# EAGLE design MicroNovaDisplayRevX3 (EAGLE 7.4.0)
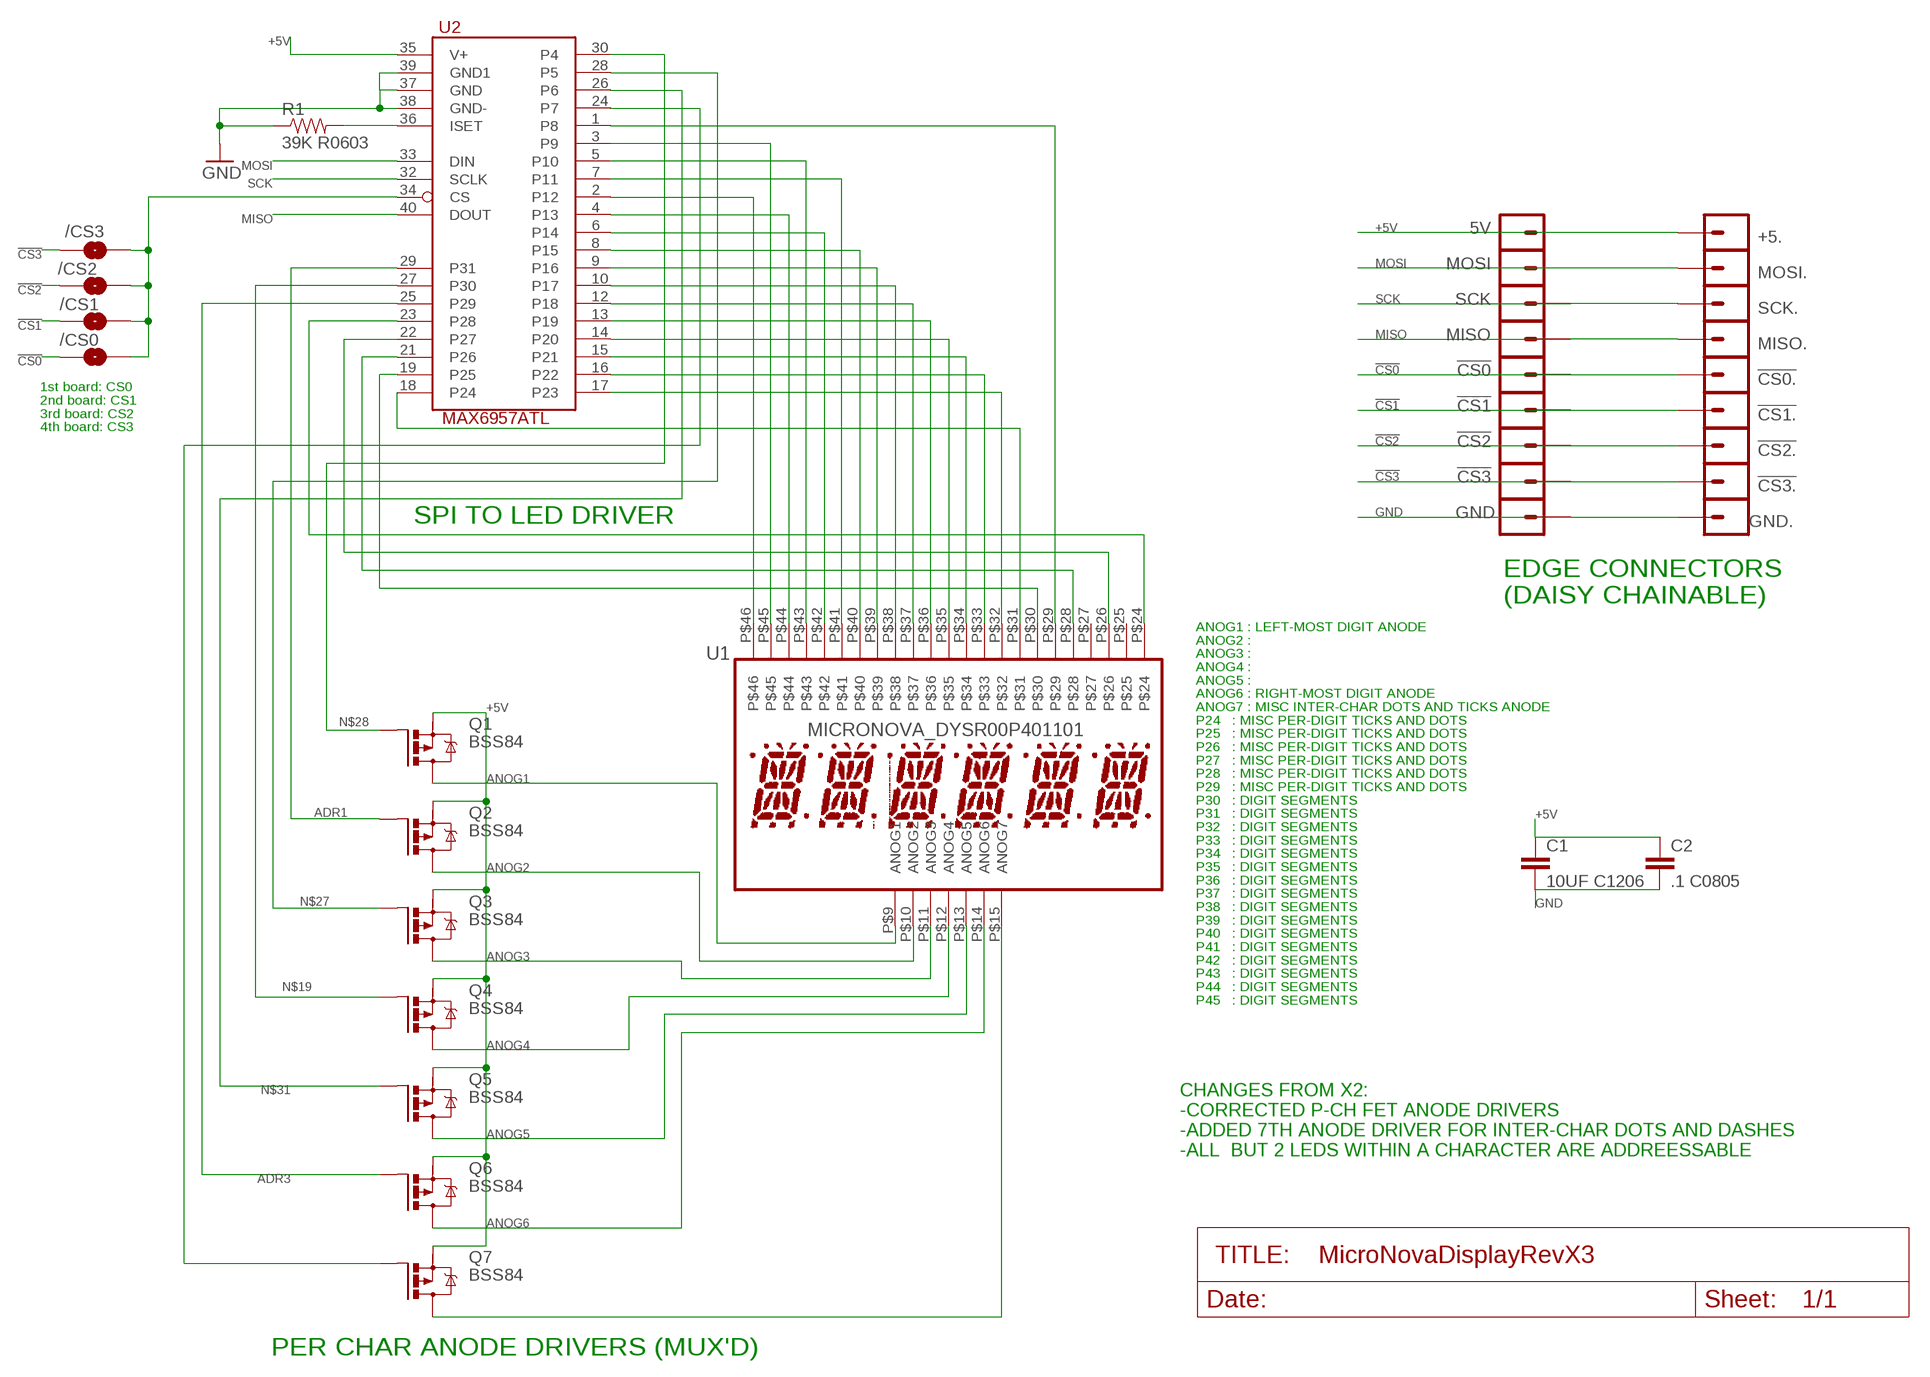
[diagram p0: schematic, sheet 1]

## Parts
5V  M01  [1X01_SMT_2MM]
!CS0  M01  [1X01_SMT_2MM]
!CS0.  M01  [1X01_SMT_2MM]
!CS1  M01  [1X01_SMT_2MM]
!CS1.  M01  [1X01_SMT_2MM]
!CS2  M01  [1X01_SMT_2MM]
!CS2.  M01  [1X01_SMT_2MM]
!CS3  M01  [1X01_SMT_2MM]
!CS3.  M01  [1X01_SMT_2MM]
+5.  M01  [1X01_SMT_2MM]
/CS0  JUMPER-PAD-2-NOYES_SILK  [PAD-JUMPER-2-NO_YES_SILK]
/CS1  JUMPER-PAD-2-NOYES_SILK  [PAD-JUMPER-2-NO_YES_SILK]
/CS2  JUMPER-PAD-2-NOYES_SILK  [PAD-JUMPER-2-NO_YES_SILK]
/CS3  JUMPER-PAD-2-NOYES_SILK  [PAD-JUMPER-2-NO_YES_SILK]
C1  10UF C1206  CAP1206  [1206]
C2  .1 C0805  CAP0805  [0805]
GND  M01  [1X01_SMT_2MM]
GND.  M01  [1X01_SMT_2MM]
MISO  M01  [1X01_SMT_2MM]
MISO.  M01  [1X01_SMT_2MM]
MOSI  M01  [1X01_SMT_2MM]
MOSI.  M01  [1X01_SMT_2MM]
Q1  BSS84  MOSFET-PCHANNELGATE1_SOURCE2_DRAIN3  [SOT23-3]
Q2  BSS84  MOSFET-PCHANNELGATE1_SOURCE2_DRAIN3  [SOT23-3]
Q3  BSS84  MOSFET-PCHANNELGATE1_SOURCE2_DRAIN3  [SOT23-3]
Q4  BSS84  MOSFET-PCHANNELGATE1_SOURCE2_DRAIN3  [SOT23-3]
Q5  BSS84  MOSFET-PCHANNELGATE1_SOURCE2_DRAIN3  [SOT23-3]
Q6  BSS84  MOSFET-PCHANNELGATE1_SOURCE2_DRAIN3  [SOT23-3]
Q7  BSS84  MOSFET-PCHANNELGATE1_SOURCE2_DRAIN3  [SOT23-3]
R1  39K R0603  RES0603  [0603]
SCK  M01  [1X01_SMT_2MM]
SCK.  M01  [1X01_SMT_2MM]
U1  MICRONOVA_DYSR00P401101  [ALPHANUMERIC]
U2  MAX6957ATL  [TQFP40]

## Nets
!CS0: !CS0..P$1 !CS0.P$1 /CS0.1
!CS1: !CS1..P$1 !CS1.P$1 /CS1.1
!CS2: !CS2..P$1 !CS2.P$1 /CS2.1
!CS3: !CS3..P$1 !CS3.P$1 /CS3.1
+5V: 5V.P$1 +5..P$1 C1.1 C2.1 Q1.2(1S) Q2.2(1S) Q3.2(1S) Q4.2(1S) Q5.2(1S) Q6.2(1S) Q7.2(1S) U2.35(V+)
ADR1: Q2.1(2G) U2.29(P31)
ADR3: Q6.1(2G) U2.25(P29)
ADR4: Q7.1(2G) U2.24(P7)
ADR5: U1.P$30 U2.19(P25)
ADR6: U1.P$28 U2.21(P26)
ANOG1: Q1.3(3D) U1.P$9(ANOG1)
ANOG2: Q2.3(3D) U1.P$10(ANOG2)
ANOG3: Q3.3(3D) U1.P$11(ANOG3)
ANOG4: Q4.3(3D) U1.P$12(ANOG4)
ANOG5: Q5.3(3D) U1.P$13(ANOG5)
ANOG6: Q6.3(3D) U1.P$14(ANOG6)
GND: C1.2 C2.2 GND..P$1 GND.P$1 R1.1 U2.37(GND) U2.38(GND-) U2.39(GND1)
MISO: MISO..P$1 MISO.P$1 U2.40(DOUT)
MOSI: MOSI..P$1 MOSI.P$1 U2.33(DIN)
N$1: U1.P$31 U2.18(P24)
N$2: U1.P$32 U2.17(P23)
N$3: U1.P$33 U2.16(P22)
N$4: U1.P$34 U2.15(P21)
N$5: U1.P$35 U2.14(P20)
N$6: U1.P$36 U2.13(P19)
N$7: U1.P$37 U2.12(P18)
N$8: U1.P$38 U2.10(P17)
N$9: U1.P$39 U2.9(P16)
N$10: U1.P$40 U2.8(P15)
N$11: U1.P$41 U2.7(P11)
N$12: U1.P$42 U2.6(P14)
N$13: R1.2 U2.36(ISET)
N$14: U1.P$43 U2.5(P10)
N$15: U1.P$44 U2.4(P13)
N$16: U1.P$45 U2.3(P9)
N$17: U1.P$46 U2.2(P12)
N$18: U1.P$29 U2.1(P8)
N$19: Q4.1(2G) U2.27(P30)
N$20: /CS0.2 /CS1.2 /CS2.2 /CS3.2 U2.34(CS)
N$22: U1.P$26 U2.22(P27)
N$23: U1.P$24 U2.23(P28)
N$25: Q7.3(3D) U1.P$15(ANOG7)
N$27: Q3.1(2G) U2.28(P5)
N$28: Q1.1(2G) U2.30(P4)
N$31: Q5.1(2G) U2.26(P6)
SCK: SCK..P$1 SCK.P$1 U2.32(SCLK)
Unconnected: U1.P$25 U1.P$27

## Notes on the sheet
- 1st board: CS0
  2nd board: CS1
  3rd board: CS2
  4th board: CS3
- SPI TO LED DRIVER
- EDGE CONNECTORS
  (DAISY CHAINABLE)
- ANOG1 : LEFT-MOST DIGIT ANODE
  ANOG2 :
  ANOG3 :
  ANOG4 :
  ANOG5 :
  ANOG6 : RIGHT-MOST DIGIT ANODE
  ANOG7 : MISC INTER-CHAR DOTS AND TICKS ANODE
  P24   : MISC PER-DIGIT TICKS AND DOTS
  P25   : MISC PER-DIGIT TICKS AND DOTS
  P26   : MISC PER-DIGIT TICKS AND DOTS
  P27   : MISC PER-DIGIT TICKS AND DOTS
  P28   : MISC PER-DIGIT TICKS AND DOTS
  P29   : MISC PER-DIGIT TICKS AND DOTS
  P30   : DIGIT SEGMENTS
  P31   : DIGIT SEGMENTS
  P32   : DIGIT SEGMENTS
  P33   : DIGIT SEGMENTS
  P34   : DIGIT SEGMENTS
  P35   : DIGIT SEGMENTS
  P36   : DIGIT SEGMENTS
  P37   : DIGIT SEGMENTS
  P38   : DIGIT SEGMENTS
  P39   : DIGIT SEGMENTS
  P40   : DIGIT SEGMENTS
  P41   : DIGIT SEGMENTS
  P42   : DIGIT SEGMENTS
  P43   : DIGIT SEGMENTS
  P44   : DIGIT SEGMENTS
  P45   : DIGIT SEGMENTS
- CHANGES FROM X2:
  -CORRECTED P-CH FET ANODE DRIVERS
  -ADDED 7TH ANODE DRIVER FOR INTER-CHAR DOTS AND DASHES
  -ALL  BUT 2 LEDS WITHIN A CHARACTER ARE ADDREESSABLE
- PER CHAR ANODE DRIVERS (MUX'D)

## Library data of the parts
5V !CS0 !CS0. !CS1 !CS1. !CS2 !CS2. !CS3 !CS3. +5. GND GND. MISO MISO. MOSI MOSI. SCK SCK. = MicroNovaDisplayRevX3:M01: Header 1 Standard 1-pin 0.1" header. Use with straight break away headers (SKU : PRT-00116), right angle break away headers (PRT-00553), swiss pins (PRT-00743), machine pins (PRT-00117), and female headers (PRT-00115).
/CS0 /CS1-/CS3 = MicroNovaDisplayRevX3:JUMPER-PAD-2-NO
C1 = MicroNovaDisplayRevX3:CAP1206
C2 = MicroNovaDisplayRevX3:CAP0805
Q1-Q7 = MicroNovaDisplayRevX3:MOSFET-PCHANNEL
R1 = MicroNovaDisplayRevX3:RES0603
U1 = MicroNovaDisplayRevX3:MICRONOVA_DYSR00P401101: Alphanumeric LED Display Common anode. Multiple LEDs on some segments. Multiple LED colors available. Works great with A6282 driver IC. Decimal points are unfornately not connected. SKU: COM-09933.
U2 = MicroNovaDisplayRevX3:MAX6957ATL

## Net classes
1 pwrgnd: drill 0.152 mm, clearance 0.152 mm

## Board
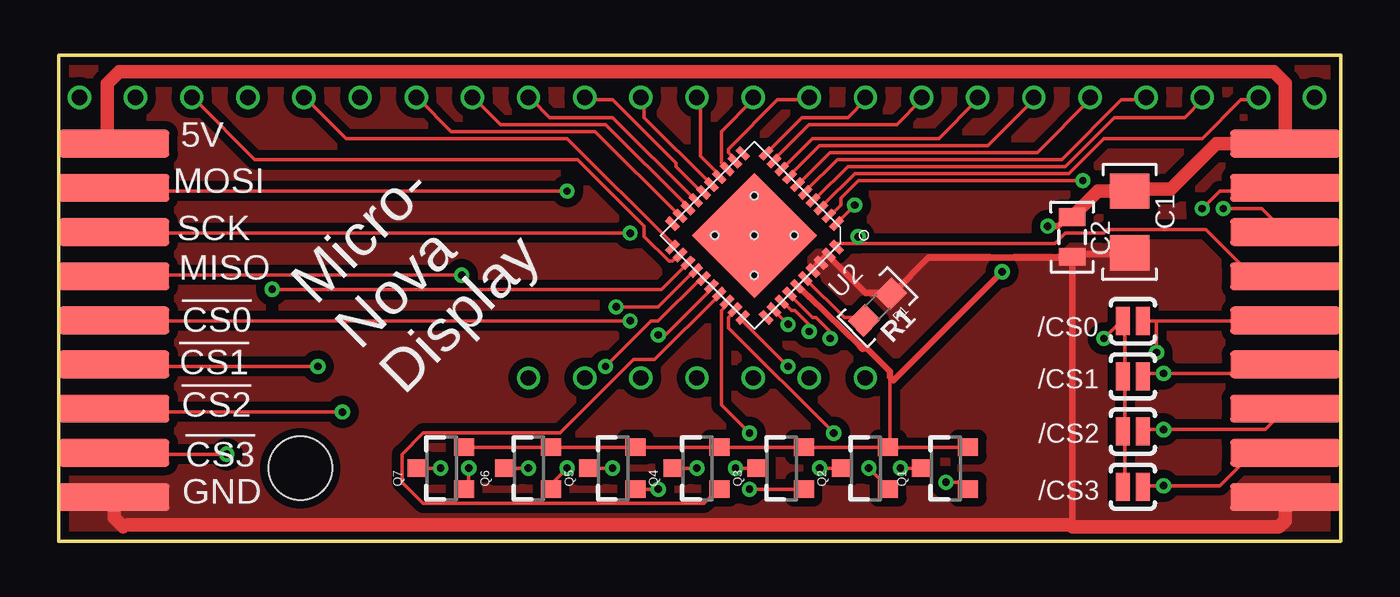
[diagram p1: board, top side]
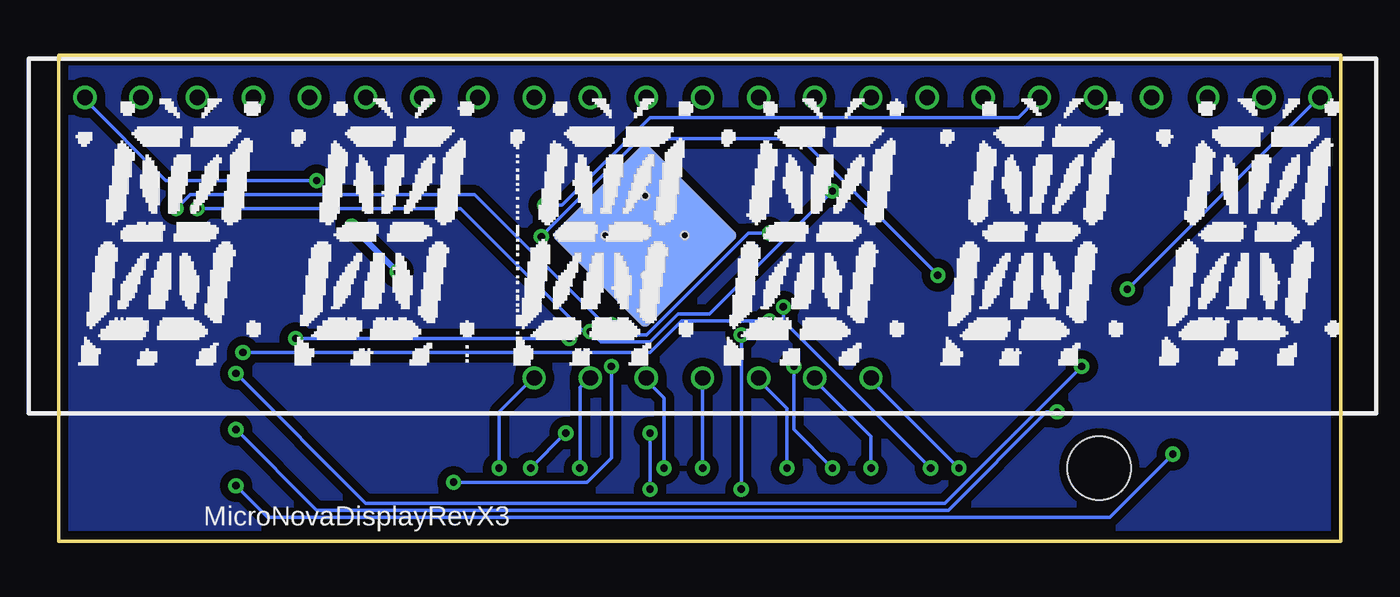
[diagram p2: board, bottom side, seen from below]

Size 58 x 22 mm. Coordinates in mm from the lower left corner, seen from the top.
Outline: 0,0 58,0 58,22 0,22 0,0
Copper layers (1*16): Top 0.0356mm / dielectric 1.5011mm / Bottom 0.0356mm
Design rules "ergonometrix4lyr *": minimum track width 6mil, minimum drill 13mil, track to track 6mil, track to pad 6mil, pad to pad 6mil, via to via 6mil, smd to smd 6mil, copper to edge 15mil, drill to drill 6mil, minimum pad ring 7mil, minimum via ring 7mil, stop-mask expansion 3mil, vias tented up to drill 20mil, thermal gap 10mil

### Footprints (pad centres in the part's own frame; a part is rotated, then mirrored left to right if it is on the bottom)
1X01_SMT_2MM = smd 5 x 1.25: P$1 0,0
PAD-JUMPER-2-NO_YES_SILK = smd 0.635 x 1.27: 1 -0.45,0; 2 0.45,0
1206 = smd 1.6 x 1.8: 1 -1.4,0; 2 1.4,0
0805 = smd 0.8 x 1.2: 1 -0.9,0; 2 0.9,0
HOLE112 = hole 2.857: 0,0
SOT23-3 = smd 0.8 x 0.9: 1 -0.95,-1; 2 0.95,-1; 3 0,1.1
0603 = smd 1.1 x 1: 1 0.85,0; 2 -0.85,0
ALPHANUMERIC = drill 0.699: P$9 -7.513,-6.226; P$10 -4.973,-6.226; P$11 -2.433,-6.226; P$12 0.107,-6.226; P$13 2.647,-6.226; P$14 5.187,-6.226; P$15 7.727,-6.226; P$24 28.047,6.474; P$25 25.502,6.464; P$26 22.962,6.464; P$27 20.427,6.474; P$28 17.887,6.474; P$29 15.347,6.474; P$30 12.807,6.474; P$31 10.267,6.474; P$32 7.727,6.474; P$33 5.187,6.474; P$34 2.647,6.474; P$35 0.107,6.474; P$36 -2.433,6.474; P$37 -4.973,6.474; P$38 -7.513,6.474; P$39 -10.053,6.474; P$40 -12.593,6.474; P$41 -15.133,6.474; P$42 -17.673,6.474; P$43 -20.213,6.474; P$44 -22.753,6.474; P$45 -25.293,6.474; P$46 -27.833,6.474
TQFP40 = smd 4 x 4: 0 0,0 | smd 0.65 x 0.3: 1 -3,2.25; 2 -3,1.75; 3 -3,1.25; 4 -3,0.75; 5 -3,0.25; 6 -3,-0.25; 7 -3,-0.75; 8 -3,-1.25; 9 -3,-1.75; 10 -3,-2.25; 21 3,-2.25; 22 3,-1.75; 23 3,-1.25; 24 3,-0.75; 25 3,-0.25; 26 3,0.25; 27 3,0.75; 28 3,1.25; 29 3,1.75; 30 3,2.25 | smd 0.3 x 0.65: 11 -2.25,-3; 12 -1.75,-3; 13 -1.25,-3; 14 -0.75,-3; 15 -0.25,-3; 16 0.25,-3; 17 0.75,-3; 18 1.25,-3; 19 1.75,-3; 20 2.25,-3; 31 2.25,3; 32 1.75,3; 33 1.25,3; 34 0.75,3; 35 0.25,3; 36 -0.25,3; 37 -0.75,3; 38 -1.25,3; 39 -1.75,3; 40 -2.25,3 | smd 6 x 6 bottom: 41 0,0 | hole 0.33: -1.27,1.27; 1.27,1.27; 1.27,-1.27; -1.27,-1.27; 0,0

### Placement (x,y rotation side)
5V  2.5,18 0 top
!CS0  2.5,10 0 top
!CS0.  55.5,10 0 top
!CS1  2.5,8 0 top
!CS1.  55.5,8 0 top
!CS2  2.5,6 0 top
!CS2.  55.5,6 0 top
!CS3  2.5,4 0 top
!CS3.  55.5,4 0 top
+5.  55.5,18 0 top
/CS0  48.59,9.97 180 top
/CS1  48.59,7.47 180 top
/CS2  48.59,4.97 180 top
/CS3  48.59,2.47 180 top
C1  48.45,14.45 270 top
C2  45.84,13.78 270 top
GND  2.5,2 0 top
GND.  55.5,2 0 top
JP4  MTGHOLE110MIL  [HOLE112]  10.93,3.31 90 top
MISO  2.5,12 0 top
MISO.  55.5,12 0 top
MOSI  2.5,16 0 top
MOSI.  55.5,16 0 top
Q1  40.14,3.31 90 top
Q2  36.52,3.31 90 top
Q3  32.71,3.31 90 top
Q4  28.9,3.31 90 top
Q5  25.09,3.31 90 top
Q6  21.28,3.31 90 top
Q7  17.33,3.31 90 top
R1  37.04,10.6 45 top
SCK  2.5,14 0 top
SCK.  55.5,14 0 top
U1  28.98,13.62 0 bottom
U2  31.47,13.85 225 top

### Tracks (layer width: path | path; a pad name or v marks a point on that pad's centre or on a via)
!CS0  (via drill 0.33)
  Top 0.152: 49.66,9.98 55.38,9.98 !CS0..P$1 | 49.66,9.98 49.19,9.98 /CS0.1 | v25.85,9.98 2.52,9.98 !CS0.P$1 | 49.66,9.98 v49.66,8.55
  Bottom 0.152: v25.85,9.98 29.82,9.98 31.25,8.55 v49.66,8.55
!CS1  (via drill 0.33)
  Top 0.152: /CS1.1 49.19,7.6 v49.98,7.6 55.06,7.6 55.38,7.91 !CS1..P$1 | v11.72,7.91 2.52,7.91 !CS1.P$1
  Bottom 0.152: v11.72,7.91 17.91,1.72 44.11,1.72 v49.98,7.6
!CS2  (via drill 0.33)
  Top 0.152: /CS2.1 49.19,5.06 v49.98,5.06 54.59,5.06 55.38,5.85 !CS2..P$1 | v12.84,5.85 2.52,5.85 !CS2.P$1
  Bottom 0.152: v12.84,5.85 13.31,5.85 17.76,1.41 46.33,1.41 v49.98,5.06
!CS3  (via drill 0.33)
  Top 0.152: /CS3.1 49.19,2.52 v49.98,2.52 52.52,2.52 53.95,3.95 55.38,3.95 !CS3..P$1 | v7.6,3.95 2.52,3.95 !CS3.P$1
  Bottom 0.152: v7.6,3.95 10.45,1.09 48.55,1.09 v49.98,2.52
+5V  (via drill 0.33)
  Top 0.152: 37.6,4.26 41.09,4.26 Q1.2 | 37.6,7.44 37.6,4.26 | 37.6,4.26 Q2.2 37.28,4.26 33.79,4.26 Q3.2 Q4.2 29.66,4.26 26.17,4.26 Q5.2 25.85,4.26 22.36,4.26 Q6.2 22.04,4.26 18.55,4.26 Q7.2
  Top 0.203: 33.95,11.09 33.91,11.08 | 33.59,11.39 U2.35 | 45.7,14.74 C2.1 | 37.75,7.25 37.76,7.28
  Top 0.305: 33.91,11.08 33.59,11.39 | 33.95,11.09 36.21,8.86 36.36,8.71 36.55,8.73 37.6,7.68 37.6,7.44 37.76,7.28 v42.68,12.2 | v44.74,14.26 45.22,14.26 45.7,14.74
  Top 0.61: 5V.P$1 2.2,18 2.2,20.71 2.75,21.26 54.97,21.26 55.5,20.73 +5..P$1 | +5..P$1 | +5..P$1 52.37,18 50.31,15.95 48.55,15.95 C1.1 47.02,15.85 C2.1
  Bottom 0.305: v44.74,14.26 v42.68,12.2
ADR1  (via drill 0.33)
  Top 0.152: v35.06,4.9 30.3,9.66 30.3,10.14 30.46,10.29 30.46,10.45 U2.29 | v36.65,3.31 37.44,2.52 Q2.1
  Bottom 0.152: v36.65,3.31 v35.06,4.9
ADR3  (via drill 0.33)
  Top 0.152: v24.74,7.91 26.8,9.98 27.12,9.98 29.03,11.88 U2.25 | v23,3.31 22.2,2.52 Q6.1
  Bottom 0.152: v24.74,7.91 24.74,5.06 v23,3.31
ADR4  (via drill 0.33)
  Top 0.152: v25.22,10.61 27.12,10.61 28.71,12.2 U2.24 | v18.55,3.31 18.55,2.67 18.39,2.52 Q7.1
  Bottom 0.152: v25.22,10.61 25.22,9.98 v18.55,3.31
ADR5
  Top 0.152: U2.19 28.07,14.74 24.27,18.55 17.76,18.55 16.33,19.98 U1.P$30
ADR6
  Top 0.152: U2.21 27.76,13.47 23,18.23 12.99,18.23 11.25,19.98 U1.P$28
ANOG1  (via drill 0.33)
  Top 0.152: v38.08,3.31 Q1.3
  Bottom 0.152: v38.08,3.31 38.08,5.85 36.65,7.28 U1.P$9
ANOG2  (via drill 0.33)
  Top 0.152: v34.42,3.31 Q2.3
  Bottom 0.152: v34.42,3.31 34.42,6.96 34.11,7.28 U1.P$10
ANOG3  (via drill 0.33)
  Top 0.152: v30.61,3.31 Q3.3
  Bottom 0.152: v30.61,3.31 30.61,6.49 31.41,7.28 U1.P$11
ANOG4  (via drill 0.33)
  Top 0.152: v28.87,3.31 Q4.3
  Bottom 0.152: v28.87,3.31 28.87,7.28 U1.P$12
ANOG5  (via drill 0.33)
  Top 0.152: v25.06,3.31 Q5.3
  Bottom 0.152: v25.06,3.31 25.06,6.01 26.33,7.28 U1.P$13
ANOG6  (via drill 0.33)
  Top 0.152: v21.25,3.31 Q6.3
  Bottom 0.152: v21.25,3.31 21.25,4.74 23.79,7.28 U1.P$14
GND
  Top 0.203: 45.85,12.99 C2.2 | 48.4,12.99 C1.2 | 34.42,12.68 34.11,12.36 U2.37 | 34.42,12.68 34.74,12.99 U2.39 34.9,12.84 | 34.42,12.68 U2.38 | 37.6,11.25 R1.1 37.76,11.25 | 45.7,12.84 C2.2 | 45.85,12.84 C2.2 | 3.12,0.75 2.91,0.65 | 45.62,0.75 45.85,0.65
  Top 0.305: 48.4,12.99 45.85,12.99 | 37.6,11.25 36.49,11.25 34.9,12.84 | 45.7,12.84 39.35,12.84 37.76,11.25 | 45.85,0.65 45.85,12.84
  Top 0.61: GND.P$1 2.5,1.06 2.91,0.65 | 45.85,0.65 55.19,0.65 55.48,0.94 55.49,0.94 GND..P$1 | 45.62,0.75 3.12,0.75
  pour Top (isolate 0.381, no thermals, hatched): 0,21.7 57.87,21.86 57.87,0.14 0.14,0.14
  pour Bottom (isolate 0.381, no thermals, hatched): 57.92,21.73 -0.1,21.79 0.14,0.14 57.87,0.14
MISO  (via drill 0.33)
  Top 0.152: 36.17,13.47 45.06,13.47 45.54,13.95 47.28,13.95 47.44,14.11 51.89,14.11 53.95,12.04 55.38,12.04 MISO..P$1 | 36.17,13.47 35.22,13.47 U2.40 | v18.23,12.04 2.52,12.04 MISO.P$1 | 36.17,13.47 v36.17,13.79
  Bottom 0.152: v18.23,12.04 24.42,18.23 31.73,18.23 v36.17,13.79
MOSI  (via drill 0.33)
  Top 0.152: v33.95,9.5 33.95,9.82 33.31,10.45 33.16,10.45 32.84,10.77 U2.33 | v51.73,15.06 52.52,15.85 55.38,15.85 MOSI..P$1 | v23,15.85 2.52,15.85 MOSI.P$1
  Bottom 0.152: v51.73,15.06 39.82,15.06 34.27,9.5 v33.95,9.5 33.47,9.03 31.25,9.03 29.98,10.29 28.55,10.29 v23,15.85
N$1
  Top 0.152: U2.18 28.39,15.22 24.74,18.87 19.98,18.87 18.87,19.98 U1.P$31
N$2
  Top 0.152: U2.17 28.71,15.53 25.06,19.18 22.2,19.18 21.41,19.98 U1.P$32
N$3
  Top 0.152: U2.16 29.03,15.85 27.92,16.96 27.92,17.12 25.06,19.98 23.95,19.98 U1.P$33
N$4
  Top 0.152: U2.15 29.5,16.17 26.49,19.18 26.49,19.98 U1.P$34
N$5
  Top 0.152: U2.14 29.82,16.64 29.03,17.44 29.03,19.98 U1.P$35
N$6
  Top 0.152: U2.13 30.14,16.96 29.98,17.12 29.98,18.55 31.41,19.98 U1.P$36
N$7
  Top 0.152: U2.12 30.46,17.28 30.46,17.44 30.3,17.6 30.3,17.76 32.52,19.98 33.95,19.98 U1.P$37
N$8
  Top 0.152: U2.10 32.04,17.6 33.63,19.18 35.7,19.18 36.49,19.98 U1.P$38
N$9
  Top 0.152: U2.9 32.36,17.28 33.95,18.87 37.92,18.87 39.03,19.98 U1.P$39
N$10
  Top 0.152: U2.8 32.84,16.96 34.11,18.23 39.82,18.23 41.57,19.98 U1.P$40
N$11
  Top 0.152: U2.7 33.16,16.64 34.42,17.91 42.05,17.91 44.11,19.98 U1.P$41
N$12
  Top 0.152: U2.6 33.47,16.17 34.9,17.6 44.27,17.6 46.65,19.98 U1.P$42
N$13
  Top 0.152: U2.36 33.79,11.88 35.54,10.14 36.33,10.14 R1.2
N$14
  Top 0.152: U2.5 33.79,15.85 35.22,17.28 45.38,17.28 48.08,19.98 49.19,19.98 U1.P$43
N$15
  Top 0.152: U2.4 34.27,15.53 35.7,16.96 45.54,16.96 47.76,19.18 50.94,19.18 51.73,19.98 U1.P$44
N$16
  Top 0.152: U2.3 34.58,15.22 36.01,16.64 45.7,16.64 47.28,18.23 51.73,18.23 53.48,19.98 54.27,19.98 U1.P$45
N$17  (via drill 0.33)
  Top 0.152: v46.33,16.33 36.17,16.33 35.38,15.53 35.38,15.22 34.9,14.74 U2.2
  Bottom 0.152: v46.33,16.33 53.16,16.33 56.81,19.98 U1.P$46
N$18  (via drill 0.33)
  Top 0.152: v36.01,15.22 35.22,14.42 U2.1
  Bottom 0.152: v36.01,15.22 35.22,15.22 31.25,19.18 14.58,19.18 13.79,19.98 U1.P$29
N$19
  Top 0.152: U2.27 29.82,11.09 26.96,8.23 26.01,8.23 22.68,4.9 16.49,4.9 15.53,3.95 15.53,2.67 16.49,1.72 29.19,1.72 29.82,2.36 Q4.1
N$20  (via drill 0.33)
  Top 0.152: /CS3.2 48.24,2.52 48.24,4.9 /CS2.2 48.24,5.06 48.24,7.44 /CS1.2 48.24,7.6 48.24,9.82 /CS0.2 48.08,9.98 v47.28,9.18 | v34.9,9.18 34.9,9.5 34.27,10.14 34.11,10.14 33.16,11.09 U2.34
  Bottom 0.152: v47.28,9.18 v34.9,9.18
N$22
  Top 0.152: U2.22 28.07,12.84 27.92,12.84 27.76,12.68 27.6,12.68 26.49,13.79 26.49,14.26 23.47,17.28 8.87,17.28 6.17,19.98 U1.P$26
N$23  (via drill 0.33)
  Top 0.152: v9.66,11.41 27.28,11.41 28.39,12.52 U2.23
  Bottom 0.152: v9.66,11.41 1.09,19.98 U1.P$24
N$25  (via drill 0.33)
  Top 0.152: v17.28,3.31 Q7.3
  Bottom 0.152: v17.28,3.31 21.25,7.28 U1.P$15
N$27  (via drill 0.33)
  Top 0.152: v31.25,4.9 29.98,6.17 29.98,10.45 30.14,10.61 30.14,10.77 U2.28 | v31.25,2.36 33.63,2.36 Q3.1
  Bottom 0.152: v31.25,2.36 v31.25,4.9
N$28  (via drill 0.33)
  Top 0.152: v33,7.91 30.93,9.98 U2.30 | v40.14,2.67 40.93,2.67 41.09,2.52 Q1.1
  Bottom 0.152: v33,7.91 33,3.79 34.11,2.67 v40.14,2.67
N$31  (via drill 0.33)
  Top 0.152: v27.12,9.34 27.44,9.34 29.5,11.41 U2.26 | v27.12,2.36 26.17,2.36 Q5.1
  Bottom 0.152: v27.12,2.36 v27.12,9.34
SCK  (via drill 0.33)
  Top 0.152: v33,9.82 32.36,10.45 U2.32 | v52.68,15.06 54.43,15.06 55.38,14.11 SCK..P$1 | v25.85,13.95 2.52,13.95 SCK.P$1
  Bottom 0.152: v52.68,15.06 52.05,15.69 39.19,15.69 33.31,9.82 v33,9.82 32.52,9.34 31.41,9.34 26.8,13.95 v25.85,13.95

### Text on the board
tPlace: Micro- / Nova / Display